# EAGLE design powersupply5v (EAGLE 9.6.2)
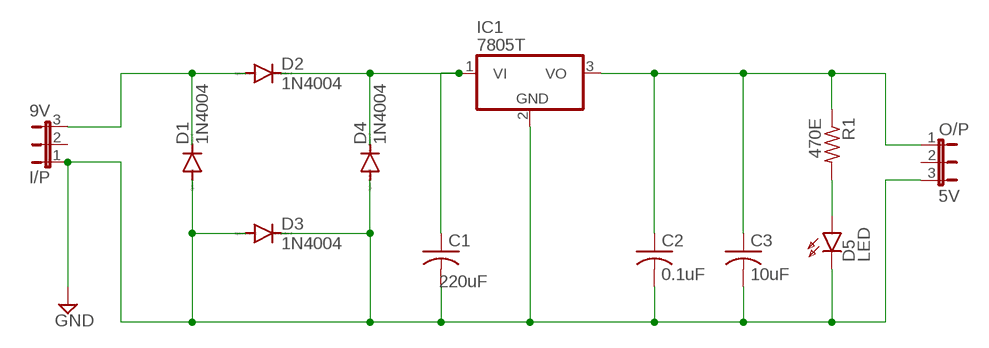
[diagram p0: schematic, sheet 1]

## Parts
C1  220uF  C-US025-024X044  [C025-024X044]
C2  0.1uF  C-US025-024X044  [C025-024X044]
C3  10uF  C-US025-024X044  [C025-024X044]
D1  1N4004  [DO41-10]
D2  1N4004  [DO41-10]
D3  1N4004  [DO41-10]
D4  1N4004  [DO41-10]
D5  LED  HLMP6  [HLMP6]
I/P  9V  JP2W  [JP2W]
IC1  7805T  [TO220H]
O/P  5V  JP2W  [JP2W]
R1  470E  R-US_0204/2V  [0204V]

## Nets
GND: C1.2 C2.2 C3.2 D1.A D3.A D3.C D4.A D5.K I/P.1 IC1.2(GND) O/P.3
N$1: C1.1 D2.C D4.C IC1.1(VI)
N$3: D1.C D2.A I/P.3
N$5: C2.1 C3.1 IC1.3(VO) O/P.1 R1.1
N$6: D5.A R1.2
Unconnected: I/P.2 O/P.2

## Library data of the parts
C1-C3 = rcl:C-US: CAPACITOR, American symbol; SPICEPREFIX: C
D1-D4 = diode:1N4004: DIODE general purpose rectifier, 1 A
D5 = display-hp:HLMP6: LED 2mm horizontal; MF: AGILENT TECHNOLOGIES; MPN: HLMP-6500; OC_FARNELL: 1652490; OC_NEWARK: 40K0088
I/P O/P = jumper:JP2W: JUMPER
IC1 = linear:78*: Positive VOLTAGE REGULATOR Source: http://cache.national.com/ds/LM/LM78L05.pdf http://www.fairchildsemi.com/ds/LM/LM7805.pdf
R1 = rcl:R-US_: RESISTOR, American symbol; SPICEPREFIX: R

## Board
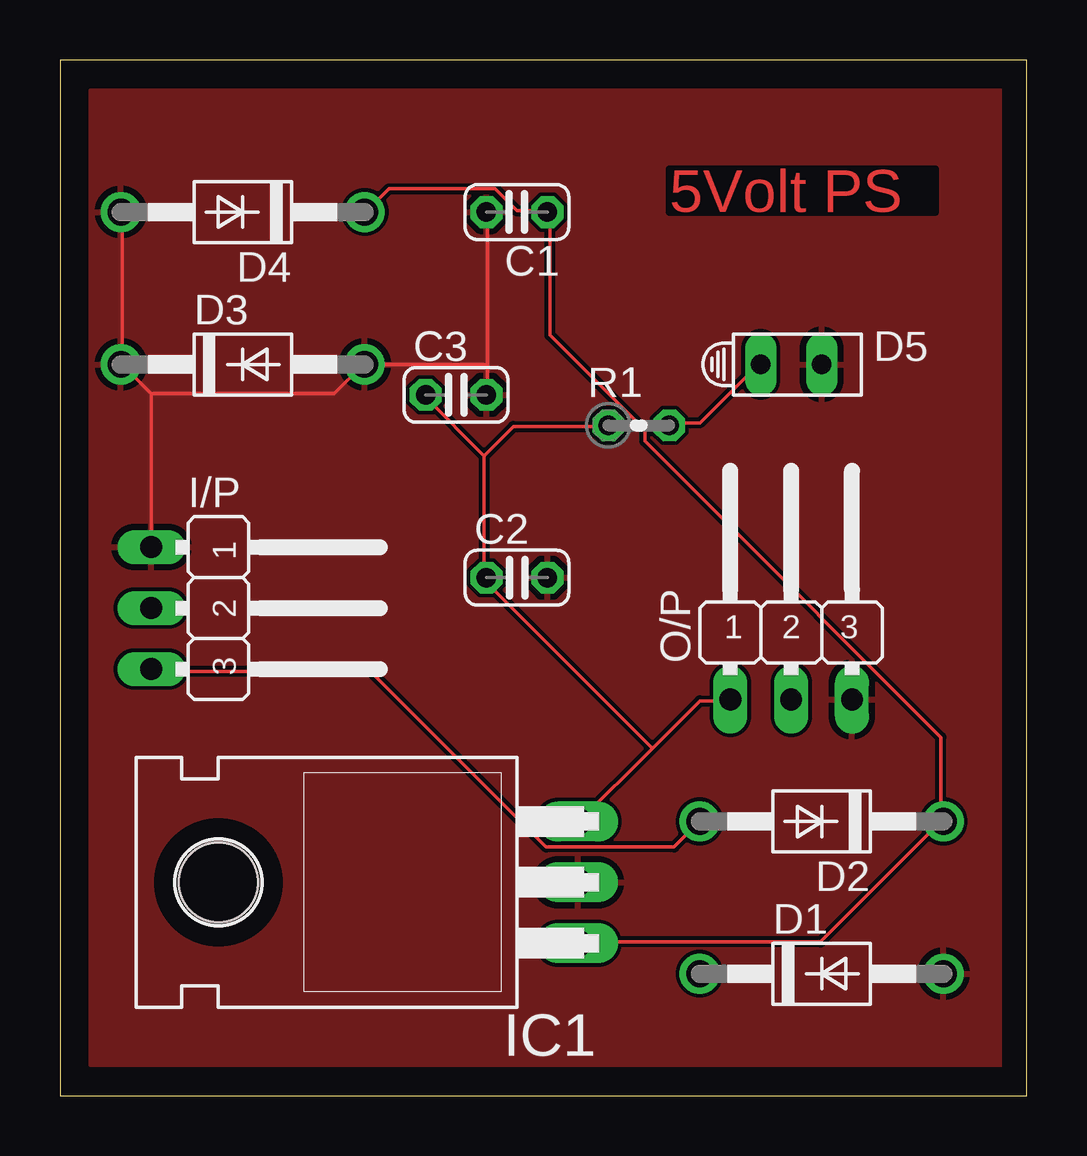
[diagram p1: board, top side]
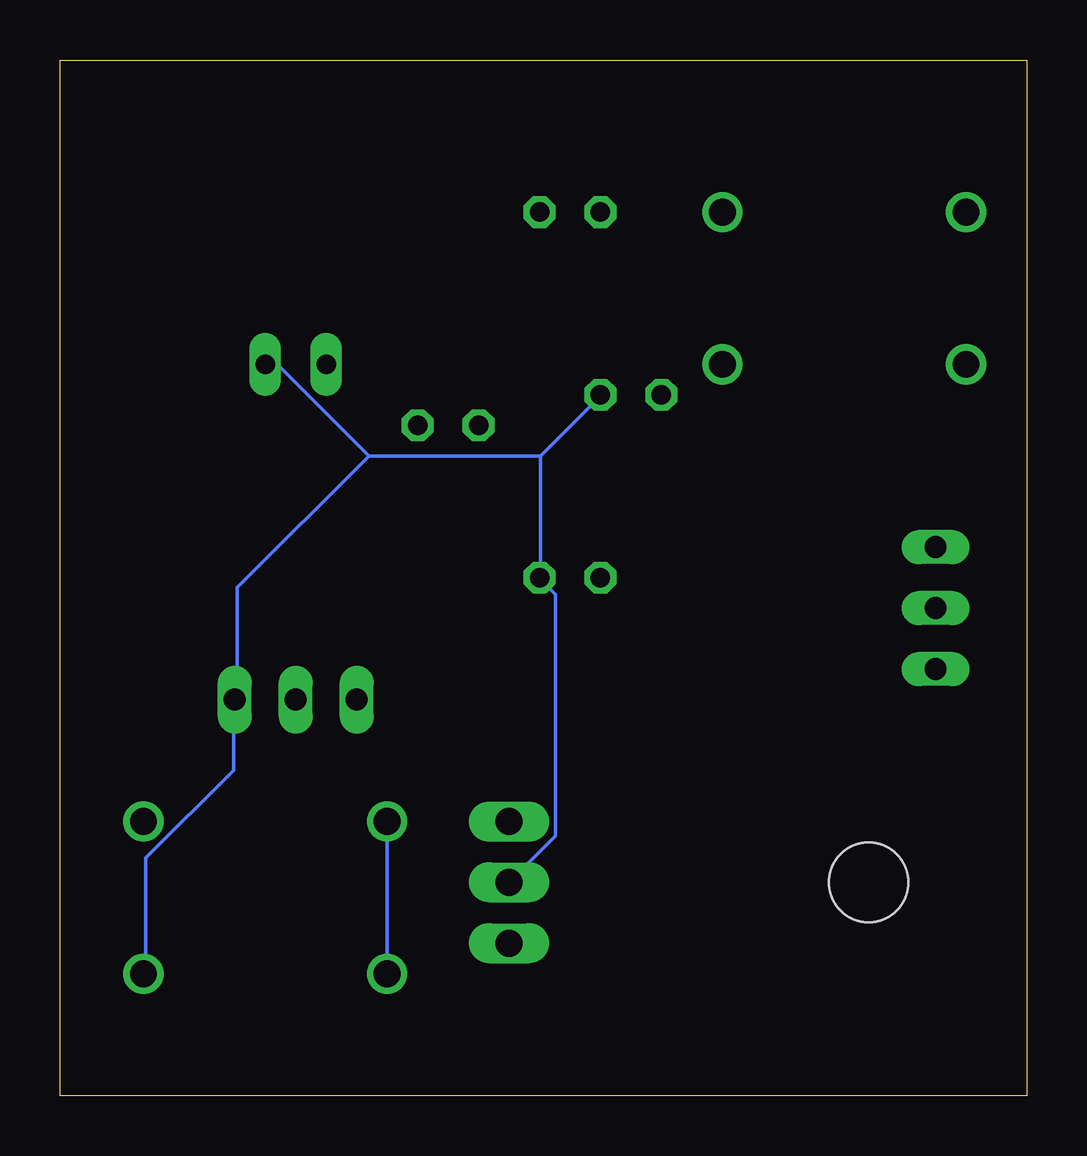
[diagram p2: board, bottom side, seen from below]

Size 40.31 x 43.17 mm. Coordinates in mm from the lower left corner, seen from the top.
Outline: 0,0 40.31,0 40.31,43.17 0,43.17 0,0
Copper layers (1*16): Top 0.035mm / dielectric 1.5mm / Bottom 0.035mm
Design rules "default": minimum track width 6mil, minimum drill 0.35mm, track to track 6mil, track to pad 6mil, pad to pad 6mil, via to via 6mil, smd to smd 6mil, copper to edge 40mil, drill to drill 6mil, minimum pad ring 10mil, minimum via ring 8mil, stop-mask expansion 4mil, vias tented up to drill 0mil, thermal gap 10mil

### Footprints (pad centres in the part's own frame; a part is rotated, then mirrored left to right if it is on the bottom)
C025-024X044 = drill 0.813 octagon: 1 -1.27,0; 2 1.27,0
DO41-10 = drill 1.118: A 5.08,0; C -5.08,0
HLMP6 = drill 0.813 long: A -1.27,0; K 1.27,0
JP2W = drill 0.914 long: 1 -2.54,-1.27; 2 0,-1.27; 3 2.54,-1.27
TO220H = drill 1.118 long: 1 -2.54,-10.16; 2 0,-10.16; 3 2.54,-10.16 | hole 3.302: 0,4.826
0204V = drill 0.813 octagon: 1 -1.27,0; 2 1.27,0

### Placement (x,y rotation side)
C1  19.05,36.83 180 top
C2  19.05,21.59 0 top
C3  16.51,29.21 0 top
D1  31.75,5.08 0 top
D2  31.75,11.43 180 top
D3  7.62,30.48 0 top
D4  7.62,36.83 180 top
D5  30.48,30.48 0 top
I/P  5.08,20.32 270 top
IC1  11.43,8.89 90 top
O/P  30.48,17.78 0 top
R1  24.13,27.94 0 top

### Tracks (layer width: path | path; a pad name or v marks a point on that pad's centre or on a via)
GND
  Top 0.152: 3.81,29.26 I/P.1 | 2.59,30.48 3.81,29.26 | 2.59,30.48 2.59,36.73 D4.A | 2.59,30.48 D3.C | 17.83,30.48 17.83,29.26 C3.2 | 17.83,30.48 17.83,36.73 C1.2 | 17.83,30.48 D3.A 12.65,30.48 11.43,29.26 3.81,29.26
  Bottom 0.152: 20.27,26.67 20.27,21.64 C2.2 20.27,21.49 19.66,20.88 19.66,10.82 IC1.2 | 20.27,26.67 17.83,29.11 C3.2 | D5.K 31.24,30.48 27.43,26.67 | 20.27,26.67 27.43,26.67 | 27.43,26.67 32.92,21.18 32.92,16.61 O/P.3 33.07,16.46 33.07,13.56 36.73,9.91 36.73,5.18 D1.A
  pour Top: 1.27,41.91 39.37,41.91 39.37,1.27 1.27,1.27
N$1
  Top 0.152: D4.C 12.8,36.88 13.72,37.8 18.14,37.8 19.05,36.88 20.27,36.88 C1.1 20.42,36.73 20.42,31.7 24.38,27.74 24.38,27.28 26.47,25.2 | 36.73,11.43 31.7,6.4 21.64,6.4 IC1.1 | 26.47,25.2 36.73,14.94 36.73,11.43 | 36.73,11.43 D2.C | 26.47,25.2
N$3
  Top 0.152: D2.A 25.6,10.36 20.27,10.36 12.95,17.68 3.81,17.68 I/P.3
  Bottom 0.152: D2.A D1.C
N$5
  Top 0.152: 24.69,14.48 21.64,11.43 IC1.3 | 24.69,14.48 26.67,16.46 27.89,16.46 O/P.1 | 17.68,26.67 17.68,21.64 C2.1 17.68,21.49 24.69,14.48 | 17.68,26.67 15.24,29.11 C3.1 | 17.68,26.67 18.9,27.89 22.86,27.89 R1.1
N$6
  Top 0.152: R1.2 25.45,28.04 26.67,28.04 29.11,30.48 D5.A

### Text on the board
Top: 5Volt PS